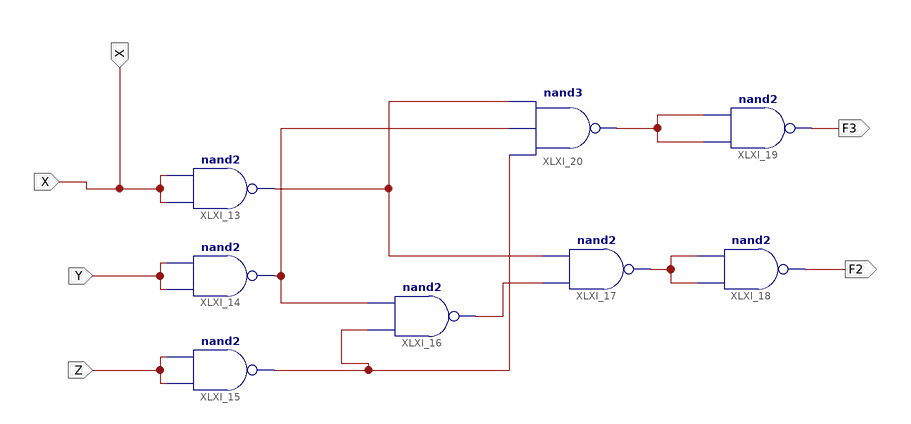
[diagram p0: schematic sheet 1]
// Xilinx ISE schematic lab4.sch (xa9500xl) as structural Verilog: 8 symbols, 5 ports
module lab4 (
  input  X,
  input  Y,
  input  Z,
  output F3,
  output F2
);

  wire XLXN_26, XLXN_28, XLXN_30, XLXN_33, XLXN_34, XLXN_36;

  nand XLXI_13 (XLXN_26, X, X);
  nand XLXI_14 (XLXN_28, Y, Y);
  nand XLXI_15 (XLXN_30, Z, Z);
  nand XLXI_16 (XLXN_33, XLXN_30, XLXN_28);
  nand XLXI_17 (XLXN_34, XLXN_33, XLXN_26);
  nand XLXI_18 (F2, XLXN_34, XLXN_34);
  nand XLXI_19 (F3, XLXN_36, XLXN_36);
  nand XLXI_20 (XLXN_36, XLXN_30, XLXN_28, XLXN_26);
endmodule
